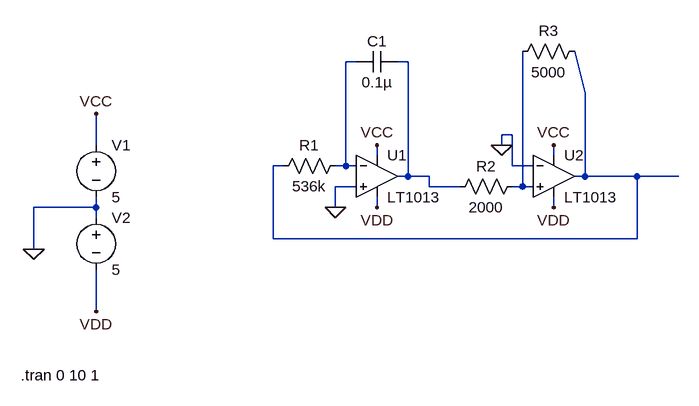
[diagram p0: schematic TrianleWaveGenerator.asc]
TrianleWaveGenerator.asc, the LTspice schematic file:
Version 4
SHEET 1 880 680
WIRE 48 -48 32 -48
WIRE 128 -48 112 -48
WIRE 400 0 384 -64
WIRE 288 64 272 64
WIRE -352 80 -352 32
WIRE 272 80 272 64
WIRE 80 96 80 80
WIRE 352 96 352 80
WIRE -64 112 -80 112
WIRE 32 112 32 -48
WIRE 32 112 16 112
WIRE 48 112 32 112
WIRE 288 112 288 64
WIRE 320 112 288 112
WIRE 128 128 128 -48
WIRE 128 128 112 128
WIRE 160 128 128 128
WIRE 400 128 400 0
WIRE 400 128 384 128
WIRE 480 128 400 128
WIRE 544 128 480 128
WIRE 48 144 16 144
WIRE 160 144 160 128
WIRE 208 144 160 144
WIRE 304 144 304 -64
WIRE 304 144 288 144
WIRE 320 144 304 144
WIRE -352 176 -352 160
WIRE -352 176 -448 176
WIRE 16 176 16 144
WIRE 80 176 80 160
WIRE 352 176 352 160
WIRE -352 192 -352 176
WIRE -80 224 -80 112
WIRE 480 224 480 128
WIRE 480 224 -80 224
WIRE -448 240 -448 176
WIRE -352 336 -352 272
FLAG 80 80 VCC
FLAG 352 80 VCC
FLAG -352 32 VCC
FLAG -448 240 0
FLAG -352 336 VDD
FLAG 16 176 0
FLAG 272 80 0
FLAG 80 176 VDD
FLAG 352 176 VDD
SYMBOL Opamps\\LT1013 80 64 R0
SYMATTR InstName U1
SYMBOL Opamps\\LT1013 352 64 R0
SYMATTR InstName U2
SYMBOL res 32 96 R90
WINDOW 0 0 56 VBottom 2
WINDOW 3 32 56 VTop 2
SYMATTR InstName R1
SYMATTR Value 536k
SYMBOL cap 112 -64 R90
WINDOW 0 0 32 VBottom 2
WINDOW 3 32 32 VTop 2
SYMATTR InstName C1
SYMATTR Value 0.1µ
SYMBOL res 400 -80 R90
WINDOW 0 0 56 VBottom 2
WINDOW 3 32 56 VTop 2
SYMATTR InstName R3
SYMATTR Value 5000
SYMBOL res 304 128 R90
WINDOW 0 0 56 VBottom 2
WINDOW 3 32 56 VTop 2
SYMATTR InstName R2
SYMATTR Value 2000
SYMBOL voltage -352 64 R0
SYMATTR InstName V1
SYMATTR Value 5
SYMBOL voltage -352 176 R0
SYMATTR InstName V2
SYMATTR Value 5
TEXT -468 434 Left 2 !.tran 0 10 1

The netlist it stands for:
* TrianleWaveGenerator.asc
XU1 0 N001 VCC VDD N002 LT1013  ; pins In+ In- V+ V- OUT
XU2 N004 0 VCC VDD N003 LT1013  ; pins In+ In- V+ V- OUT
R1 N001 N003 536k
C1 N002 N001 0.1µ
R3 N003 N004 5000
R2 N004 N002 2000
V1 VCC 0 5
V2 0 VDD 5
.tran 0 10 1
.lib LTC.lib
.backanno
.end